# EAGLE design Reciever (EAGLE 9.4.2)
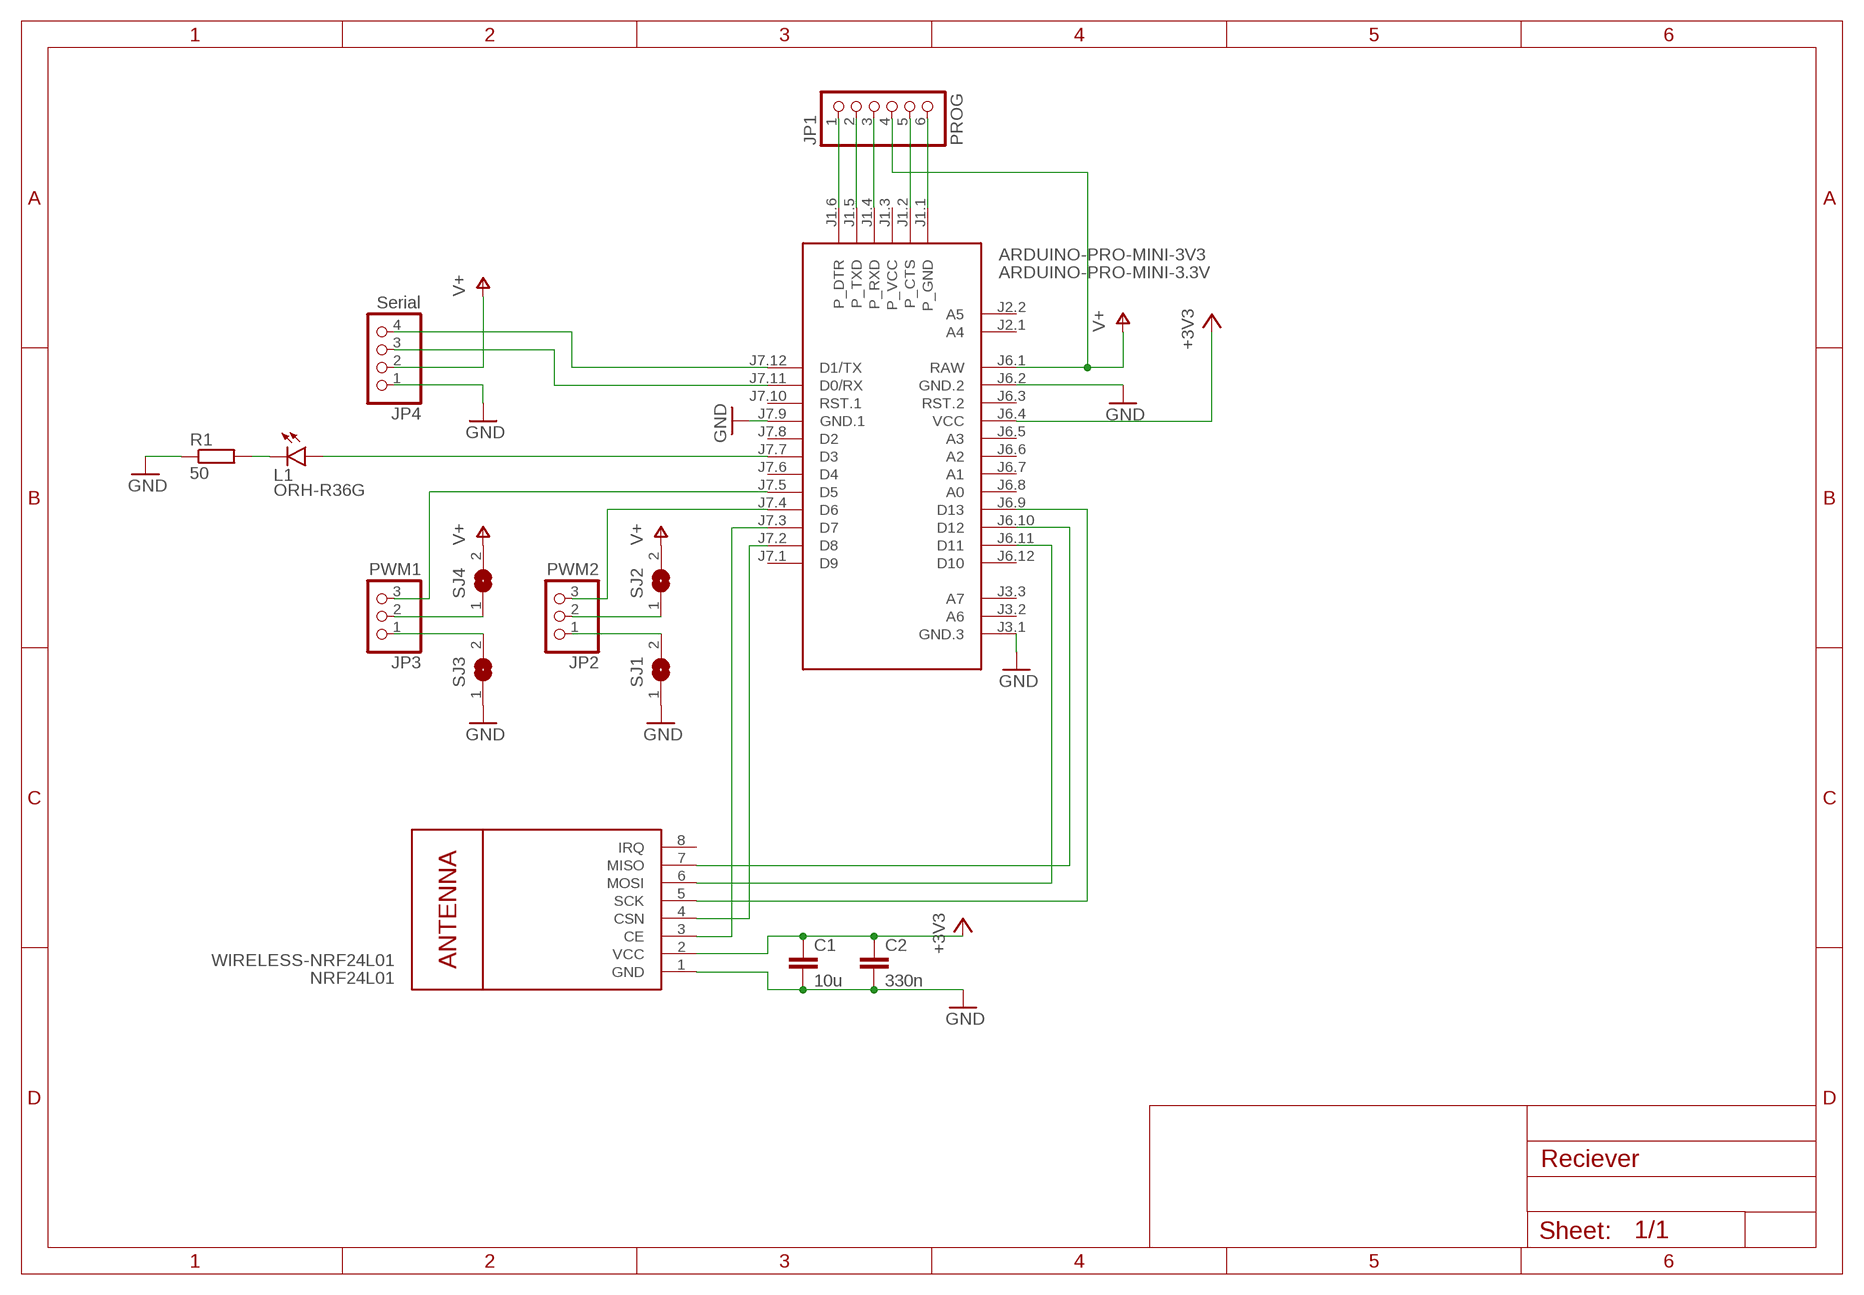
[diagram p0: schematic, sheet 1]

## Parts
ARDUINO-PRO-MINI-3V3  ARDUINO-PRO-MINI-3.3V  [ARDUINO-PRO-MINI]
C1  10u  C-EUC0805  [C0805]
C2  330n  C-EUC0805  [C0805]
JP1  PROG  PINHD-1X6  [1X06]
JP2  PWM2  PINHD-1X3/90  [1X03/90]
JP3  PWM1  PINHD-1X3/90  [1X03/90]
JP4  Serial  PINHD-1X4  [1X04]
L1  ORH-R36G  LEDCHIP-LED0603  [CHIP-LED0603]
NRF24L01  WIRELESS-NRF24L01  [WIRELESS-NRF24L01]
R1  50  R-EU_R0603  [R0603]
SJ1  SJW  [SJW]
SJ2  SJW  [SJW]
SJ3  SJW  [SJW]
SJ4  SJW  [SJW]

## Nets
+3V3: ARDUINO-PRO-MINI-3V3.J6.4(VCC) C1.1 C2.1 NRF24L01.2(VCC)
GND: ARDUINO-PRO-MINI-3V3.J3.1(GND.3) ARDUINO-PRO-MINI-3V3.J6.2(GND.2) ARDUINO-PRO-MINI-3V3.J7.9(GND.1) C1.2 C2.2 JP4.1 NRF24L01.1(GND) R1.1 SJ1.1 SJ3.1
N$1: ARDUINO-PRO-MINI-3V3.J7.7(D3) L1.A
N$2: JP2.1 SJ1.2
N$3: ARDUINO-PRO-MINI-3V3.J7.5(D5) JP3.3
N$4: ARDUINO-PRO-MINI-3V3.J7.3(D7) NRF24L01.3(CE)
N$5: ARDUINO-PRO-MINI-3V3.J7.2(D8) NRF24L01.4(CSN)
N$6: ARDUINO-PRO-MINI-3V3.J6.9(D13) NRF24L01.5(SCK)
N$7: ARDUINO-PRO-MINI-3V3.J6.11(D11) NRF24L01.6(MOSI)
N$8: ARDUINO-PRO-MINI-3V3.J6.10(D12) NRF24L01.7(MISO)
N$9: JP2.2 SJ2.1
N$10: ARDUINO-PRO-MINI-3V3.J7.4(D6) JP2.3
N$11: JP3.1 SJ3.2
N$12: JP3.2 SJ4.1
N$13: ARDUINO-PRO-MINI-3V3.J7.12(D1/TX) JP4.4
N$14: ARDUINO-PRO-MINI-3V3.J7.11(D0/RX) JP4.3
N$15: L1.C R1.2
N$16: ARDUINO-PRO-MINI-3V3.J1.6(P_DTR) JP1.1
N$17: ARDUINO-PRO-MINI-3V3.J1.5(P_TXD) JP1.2
N$18: ARDUINO-PRO-MINI-3V3.J1.4(P_RXD) JP1.3
N$20: ARDUINO-PRO-MINI-3V3.J1.2(P_CTS) JP1.5
N$21: ARDUINO-PRO-MINI-3V3.J1.1(P_GND) JP1.6
V+: ARDUINO-PRO-MINI-3V3.J6.1(RAW) JP1.4 JP4.2 SJ2.2 SJ4.2
Unconnected: ARDUINO-PRO-MINI-3V3.J1.3(P_VCC) ARDUINO-PRO-MINI-3V3.J2.1(A4) ARDUINO-PRO-MINI-3V3.J2.2(A5) ARDUINO-PRO-MINI-3V3.J3.2(A6) ARDUINO-PRO-MINI-3V3.J3.3(A7) ARDUINO-PRO-MINI-3V3.J6.3(RST.2) ARDUINO-PRO-MINI-3V3.J6.5(A3) ARDUINO-PRO-MINI-3V3.J6.6(A2) ARDUINO-PRO-MINI-3V3.J6.7(A1) ARDUINO-PRO-MINI-3V3.J6.8(A0) ARDUINO-PRO-MINI-3V3.J6.12(D10) ARDUINO-PRO-MINI-3V3.J7.1(D9) ARDUINO-PRO-MINI-3V3.J7.6(D4) ARDUINO-PRO-MINI-3V3.J7.8(D2) ARDUINO-PRO-MINI-3V3.J7.10(RST.1) NRF24L01.8(IRQ)

## Library data of the parts
ARDUINO-PRO-MINI-3V3 = diy-modules:ARDUINO-PRO-MINI-*: Arduino Pro Mini and compatible devices More details available here: https://www.arduino.cc/en/Main/ArduinoBoardProMini Click here to find device on ebay.com <http://www.ebay.com/sch/arduino+pro+mini>
C1 C2 = rcl:C-EU: CAPACITOR, European symbol; SPICEPREFIX: C
JP1 = pinhead:PINHD-1X6: PIN HEADER
JP2 JP3 = pinhead:PINHD-1X3: PIN HEADER
JP4 = pinhead:PINHD-1X4: PIN HEADER
L1 = led:LED: LED OSRAM: - CHIPLED LG R971, LG N971, LY N971, LG Q971, LY Q971, LO R971, LY R971 LH N974, LH R974 LS Q976, LO Q976, LY Q976 LO Q996 - Hyper CHIPLED LW Q18S LB Q993, LB Q99A, LB R99A - SideLED LS A670, LO A670, LY A670, LG A670, LP A670 LB A673, LV A673, LT A673, LW A673 LH A674 LY A675 LS A676, LA A676, LO A676, LY A676, LW A676 LS A679, LY A679, LG A679 - Hyper Micro SIDELED® LS Y876, LA Y876, LO Y876, LY Y876 LT Y87S - SmartLED LW L88C, LW L88S LB L89C, LB L89S, LG L890 LS L89K, LO L89K, LY L89K LS L896, LA L896, LO L896, LY L896 - TOPLED LS T670, LO T670, LY T670, LG T670, LP T670 LSG T670, LSP T670, LSY T670, LOP T670, LYG T670 LG T671, LOG T671, LSG T671 LB T673, LV T673, LT T673, LW T673 LH T674 LS T676, LA T676, LO T676, LY T676, LB T676, LH T676, LSB T676, LW T676 LB T67C, LV T67C, LT T67C, LS T67K, LO T67K, LY T67K, LW E67C LS E67B, LA E67B, LO E67B, LY E67B, LB E67C, LV E67C, LT E67C LW T67C LS T679, LY T679, LG T679 LS T770, LO T770, LY T770, LG T770, LP T770 LB T773, LV T773, LT T773, LW T773 LH T774 LS E675, LA E675, LY E675, LS T675 LS T776, LA T776, LO T776, LY T776, LB T776 LHGB T686 LT T68C, LB T68C - Hyper Mini TOPLED® LB M676 - Mini TOPLED Santana® LG M470 LS M47K, LO M47K, LY M47K Source: http://www.osram.convergy.de LUXEON: - LUMILED® LXK2-PW12-R00, LXK2-PW12-S00, LXK2-PW14-U00, LXK2-PW14-V00 LXK2-PM12-R00, LXK2-PM12-S00, LXK2-PM14-U00 LXK2-PE12-Q00, LXK2-PE12-R00, LXK2-PE12-S00, LXK2-PE14-T00, LXK2-PE14-U00 LXK2-PB12-K00, LXK2-PB12-L00, LXK2-PB12-M00, LXK2-PB14-N00, LXK2-PB14-P00, LXK2-PB14-Q00 LXK2-PR12-L00, LXK2-PR12-M00, LXK2-PR14-Q00, LXK2-PR14-R00 LXK2-PD12-Q00, LXK2-PD12-R00, LXK2-PD12-S00 LXK2-PH12-R00, LXK2-PH12-S00 LXK2-PL12-P00, LXK2-PL12-Q00, LXK2-PL12-R00 Source: www.luxeon.com KINGBRIGHT: KA-3528ASYC Source: www.kingbright.com
NRF24L01 = diy-modules:WIRELESS-NRF24L01: 2.4 GHz Wireless Module based on NRF24L01 chip More details available here: http://www.electrodragon.com/w/NRF24L01 Click here to find device on ebay.com <http://www.ebay.com/sch/nrf24l01+arduino>
R1 = rcl:R-EU_: RESISTOR, European symbol; SPICEPREFIX: R
SJ1-SJ4 = jumper:SJ: SMD solder JUMPER

## Board
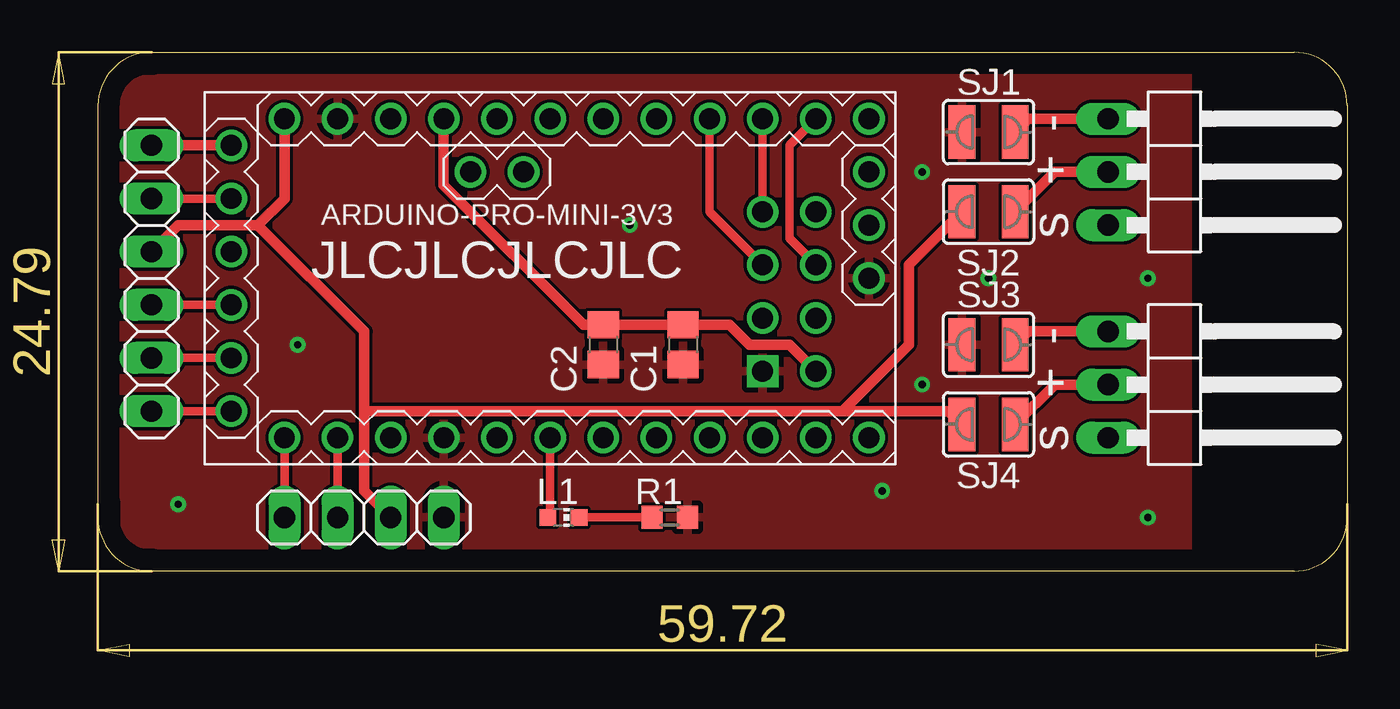
[diagram p1: board, top side]
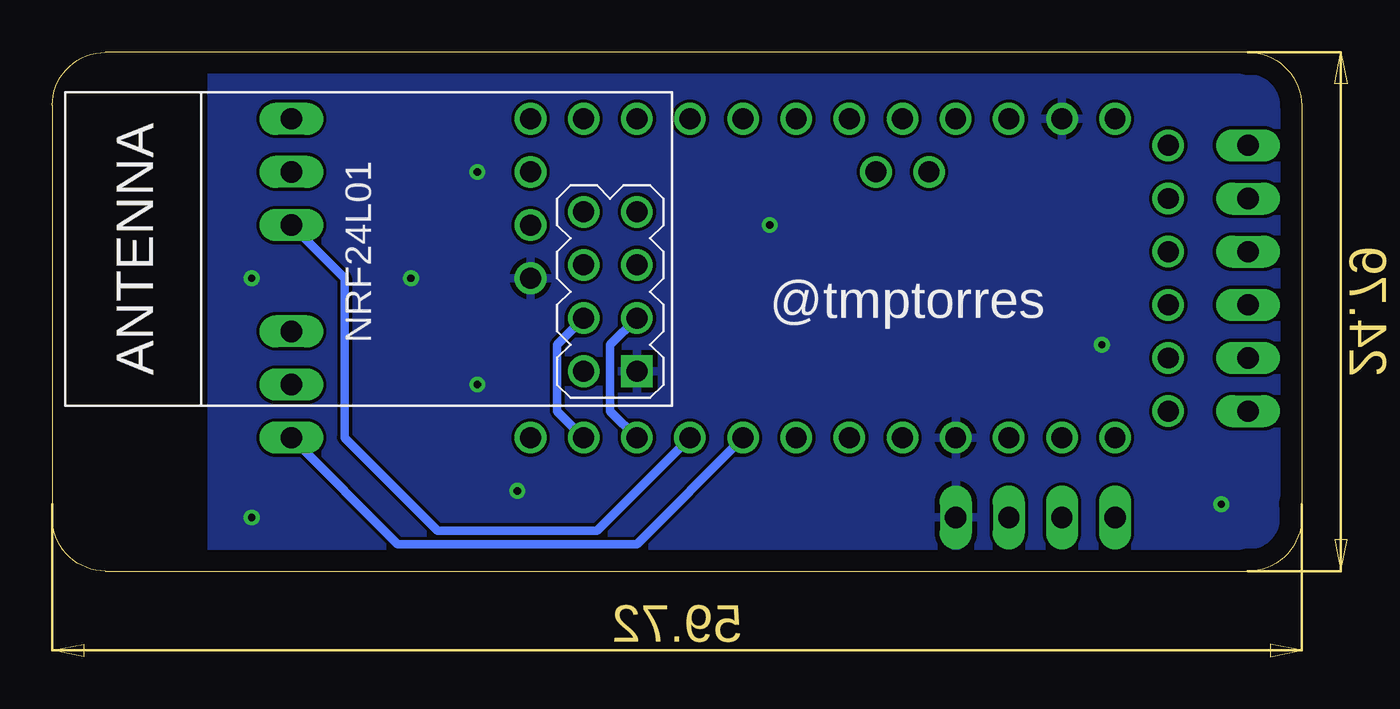
[diagram p2: board, bottom side, seen from below]

Size 59.71 x 24.79 mm. Coordinates in mm from the lower left corner, seen from the top.
Outline: 2.56,24.79 arc90 0,22.25 0,2.56 arc90 2.56,0 57.17,0 arc90 59.71,2.56 59.71,22.25 arc90 57.17,24.79 2.56,24.79
Copper layers (1*16): Top 0.035mm / dielectric 1.5mm / Bottom 0.035mm
Design rules "default": minimum track width 6mil, minimum drill 0.35mm, track to track 6mil, track to pad 6mil, pad to pad 6mil, via to via 6mil, smd to smd 6mil, copper to edge 40mil, drill to drill 6mil, minimum pad ring 10mil, minimum via ring 8mil, stop-mask expansion 4mil, vias tented up to drill 0mil, thermal gap 10mil

### Footprints (pad centres in the part's own frame; a part is rotated, then mirrored left to right if it is on the bottom)
ARDUINO-PRO-MINI = drill 1: J1.1 -15.24,6.35; J1.2 -15.24,3.81; J1.3 -15.24,1.27; J1.4 -15.24,-1.27; J1.5 -15.24,-3.81; J1.6 -15.24,-6.35; J2.1 -1.27,5.08; J2.2 -3.81,5.08; J3.1 15.24,0; J3.2 15.24,2.54; J3.3 15.24,5.08; J6.1 -12.7,7.62; J6.2 -10.16,7.62; J6.3 -7.62,7.62; J6.4 -5.08,7.62; J6.5 -2.54,7.62; J6.6 0,7.62; J6.7 2.54,7.62; J6.8 5.08,7.62; J6.9 7.62,7.62; J6.10 10.16,7.62; J6.11 12.7,7.62; J6.12 15.24,7.62; J7.1 15.24,-7.62; J7.2 12.7,-7.62; J7.3 10.16,-7.62; J7.4 7.62,-7.62; J7.5 5.08,-7.62; J7.6 2.54,-7.62; J7.7 0,-7.62; J7.8 -2.54,-7.62; J7.9 -5.08,-7.62; J7.10 -7.62,-7.62; J7.11 -10.16,-7.62; J7.12 -12.7,-7.62
C0805 = smd 1.3 x 1.5: 1 -0.95,0; 2 0.95,0
1X06 = drill 1.016 long: 1 -6.35,0; 2 -3.81,0; 3 -1.27,0; 4 1.27,0; 5 3.81,0; 6 6.35,0
1X03/90 = drill 1.016 long: 1 -2.54,-3.81; 2 0,-3.81; 3 2.54,-3.81
1X04 = drill 1.016 long: 1 -3.81,0; 2 -1.27,0; 3 1.27,0; 4 3.81,0
CHIP-LED0603 = smd 0.8 x 0.8: A 0,-0.75; C 0,0.75
WIRELESS-NRF24L01 = drill 1 square: 1 -12.7,6.35 | drill 1: 2 -10.16,6.35; 3 -12.7,3.81; 4 -10.16,3.81; 5 -12.7,1.27; 6 -10.16,1.27; 7 -12.7,-1.27; 8 -10.16,-1.27
R0603 = smd 1 x 1.1: 1 -0.85,0; 2 0.85,0
SJW = smd 1.27 x 2.54: 1 -1.27,0; 2 1.27,0

### Placement (x,y rotation side)
ARDUINO-PRO-MINI-3V3  21.61,14 0 top
C1  27.96,10.82 270 top
C2  24.15,10.82 270 top
JP1  2.56,14 90 top
JP2  52.09,19.07 270 top
JP3  52.09,8.92 270 top
JP4  12.72,2.56 180 top
L1  22.25,2.56 270 top
NRF24L01  44.48,15.9 180 bottom
R1  27.33,2.56 180 top
SJ1  42.57,20.98 0 top
SJ2  42.57,17.17 180 top
SJ3  42.57,10.82 0 top
SJ4  42.57,7.01 180 top

### Tracks (layer width: path | path; a pad name or v marks a point on that pad's centre or on a via)
+3V3
  Top 0.508: ARDUINO-PRO-MINI-3V3.J6.4 16.54,18.44 23.2,11.77 C2.1 C1.1 30.19,11.77 31.14,10.82 33.05,10.82 NRF24L01.2
GND  (via drill 0.35)
  other vias: 9.55,10.82 3.83,3.2 25.42,16.54 37.49,3.83 42.57,14 50.19,14 39.39,8.92 50.19,2.56 39.39,19.07
  pour Top: -0.61,25.42 52.09,25.42 52.09,-0.61 -0.61,-0.61
  pour Bottom: -0.61,25.42 52.09,25.42 52.09,-0.61 -0.61,-0.61
N$1
  Top 0.406: ARDUINO-PRO-MINI-3V3.J7.7 21.61,2.68 L1.A
N$2
  Top 0.508: JP2.1 44.48,21.61 SJ1.2
N$3
  Bottom 0.406: JP3.3 43.2,1.29 31.77,1.29 ARDUINO-PRO-MINI-3V3.J7.5
N$4
  Bottom 0.406: NRF24L01.3 33.05,10.82 33.05,7.65 ARDUINO-PRO-MINI-3V3.J7.3
N$5
  Bottom 0.406: NRF24L01.4 35.59,10.82 35.59,7.65 ARDUINO-PRO-MINI-3V3.J7.2
N$6
  Top 0.406: NRF24L01.5 29.23,17.17 ARDUINO-PRO-MINI-3V3.J6.9
N$7
  Top 0.406: NRF24L01.6 33.05,15.9 33.05,20.34 ARDUINO-PRO-MINI-3V3.J6.11
N$8
  Top 0.406: NRF24L01.7 ARDUINO-PRO-MINI-3V3.J6.10
N$9
  Top 0.508: JP2.2 45.74,19.07 SJ2.1
N$10
  Bottom 0.406: ARDUINO-PRO-MINI-3V3.J7.4 33.68,1.93 41.3,1.93 45.74,6.38 45.74,14 JP2.3
N$11
  Top 0.508: JP3.1 44.48,11.46 SJ3.2
N$12
  Top 0.508: JP3.2 45.74,8.92 SJ4.1
N$13
  Top 0.406: ARDUINO-PRO-MINI-3V3.J7.12 JP4.4
N$14
  Top 0.406: JP4.3 ARDUINO-PRO-MINI-3V3.J7.11
N$15
  Top 0.406: L1.C R1.2
N$16
  Top 0.406: JP1.1 ARDUINO-PRO-MINI-3V3.J1.6
N$17
  Top 0.406: JP1.2 ARDUINO-PRO-MINI-3V3.J1.5
N$18
  Top 0.406: JP1.3 ARDUINO-PRO-MINI-3V3.J1.4
N$20
  Top 0.406: JP1.5 ARDUINO-PRO-MINI-3V3.J1.2
N$21
  Top 0.508: JP1.6 ARDUINO-PRO-MINI-3V3.J1.1
V+
  Top 0.508: JP1.4 3.83,16.54 7.65,16.54 | 7.65,16.54 8.92,17.8 ARDUINO-PRO-MINI-3V3.J6.1 | JP4.2 12.72,3.83 12.72,7.65 | 7.65,16.54 12.72,11.46 12.72,7.65 | SJ2.2 38.76,14.63 38.76,10.82 35.59,7.65 | SJ4.2 40.66,7.65 35.59,7.65 | 35.59,7.65 12.72,7.65

### Text on the board
tNames: - | + | s | JLCJLCJLCJLC | - | + | s
bNames: @tmptorres